# EAGLE design lower_traced (EAGLE 9.6.2)
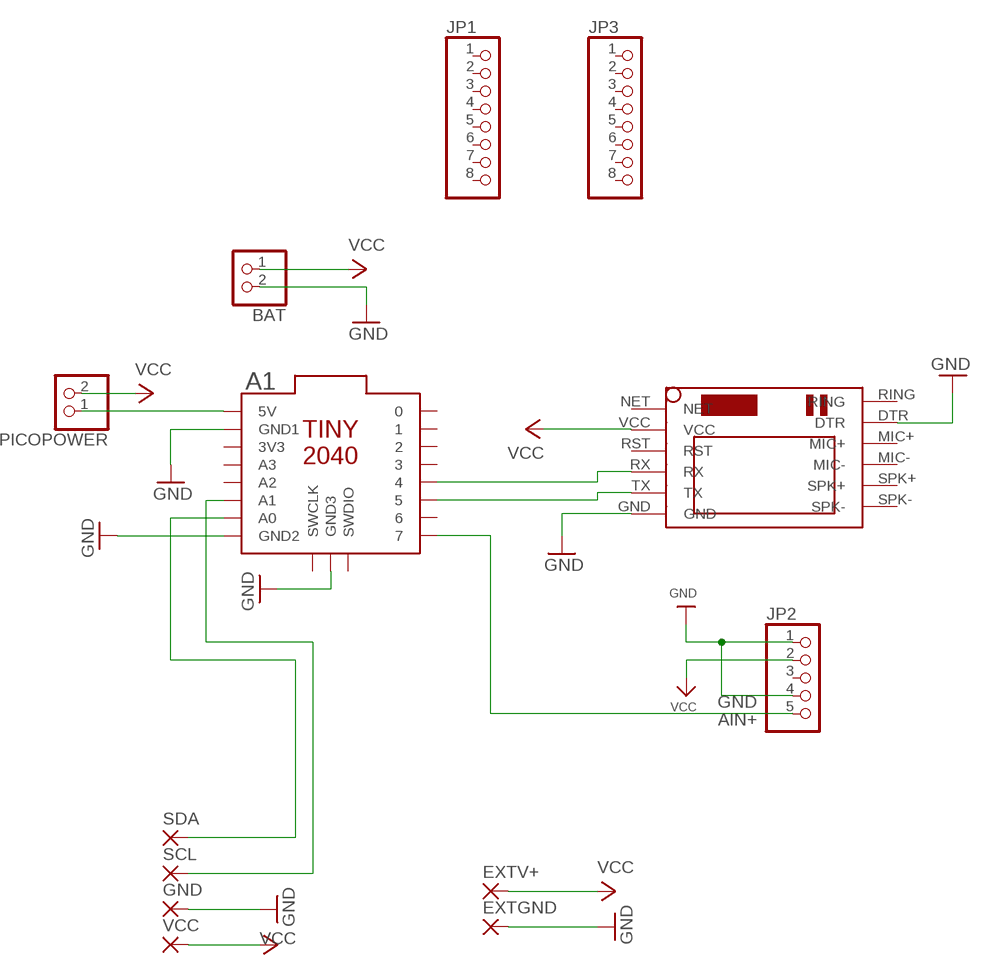
[diagram p0: schematic, sheet 1]

## Parts
A1  TINY2040  [TINY2040]
BAT  JST_2PIN-THM-RA  [JST-PH-2-THM-RA]
EXTGND  SMD5  [SMD2,54-5,08]
EXTV+  SMD5  [SMD2,54-5,08]
GND  3,17/1,1  [3,17/1,1]
JP1  PINHD-1X8  [1X08]
JP2  HEADER-1X570MIL  [1X05_ROUND_70]
JP3  PINHD-1X8  [1X08]
PICOPOWER  PINHD-1X2  [1X02]
SCL  3,17/1,1  [3,17/1,1]
SDA  3,17/1,1  [3,17/1,1]
U$2  SIM800LMODULE  [SIM800LMODULE]
VCC  3,17/1,1  [3,17/1,1]

## Nets
AIN+: A1.7 JP2.5
GND: A1.GND1 A1.GND2 A1.GND3 BAT.2 EXTGND.1(P) GND.1(P) JP2.1 JP2.4 U$2.DTR U$2.GND
N$1: A1.4 U$2.RX
N$2: A1.5 U$2.TX
N$3: A1.A1 SCL.1(P)
N$4: A1.A0 SDA.1(P)
N$5: A1.5V PICOPOWER.1
VCC: BAT.1 EXTV+.1(P) JP2.2 PICOPOWER.2 U$2.VCC VCC.1(P)
Unconnected: A1.0 A1.1 A1.2 A1.3 A1.3V3 A1.6 A1.A2 A1.A3 A1.SWCLK A1.SWDIO JP1.1 JP1.2 JP1.3 JP1.4 JP1.5 JP1.6 JP1.7 JP1.8 JP2.3 JP3.1 JP3.2 JP3.3 JP3.4 JP3.5 JP3.6 JP3.7 JP3.8 U$2.MIC+ U$2.MIC- U$2.NET U$2.RING U$2.RST U$2.SPK+ U$2.SPK-

## Library data of the parts
A1 = pimoroni-boards:TINY2040
BAT = adafruit:JST_2PIN: JST 2-Pin Connectors of various flavors SMT-RA (S2B-PH-SM4) 4UConnector #17311 SMT (B2B-PH-SM4) THM-RA (S2B-PH) THM (B2B-PH)
EXTGND EXTV+ = wirepad:SMD5: SMD PAD
GND SCL SDA VCC = wirepad:3,17/1,1: THROUGH-HOLE PAD
JP1 JP3 = pinhead:PINHD-1X8: PIN HEADER
JP2 = microbuilder:HEADER-1X5: PIN HEADER
PICOPOWER = pinhead:PINHD-1X2: PIN HEADER
U$2 = SIM800LMODULE:SIM800LMODULE: SIM800L Module

## Board
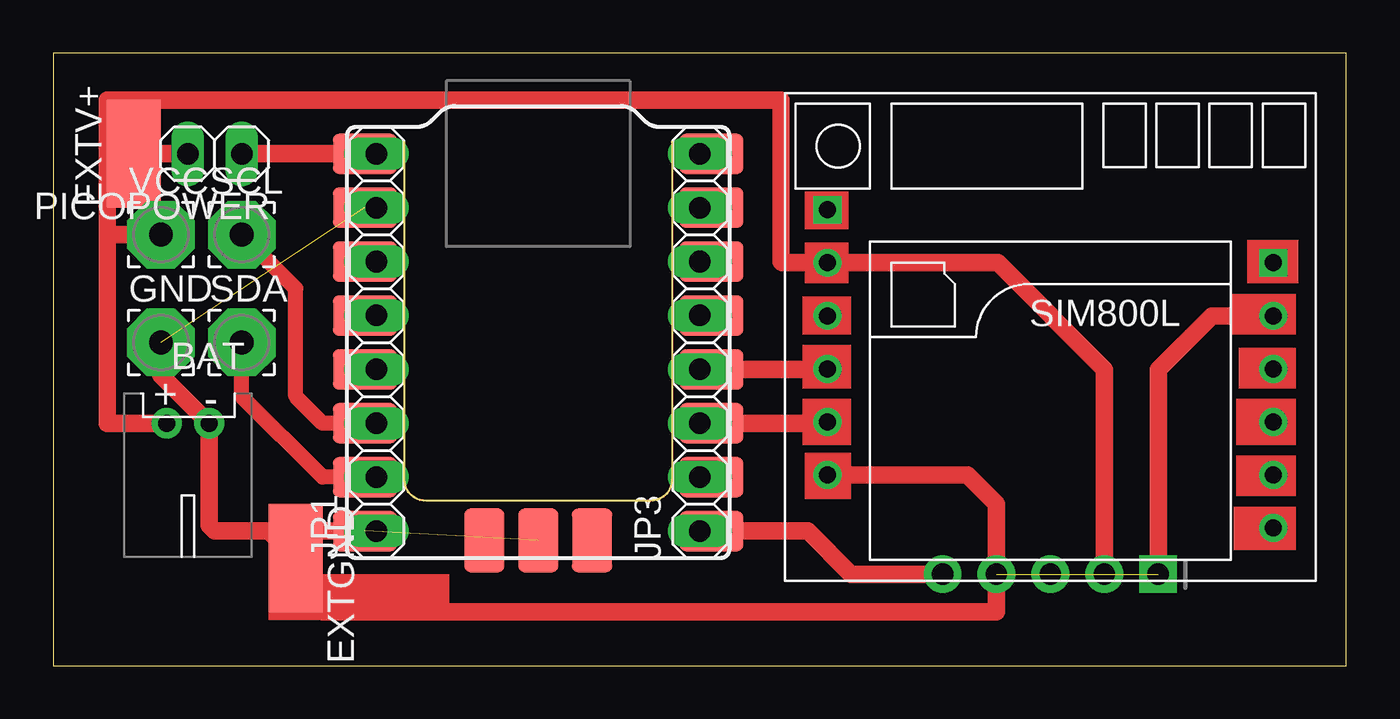
[diagram p1: board, top side]

Size 60.94 x 28.88 mm. Coordinates in mm from the lower left corner, seen from the top.
Outline: 0,0 60.94,0 60.94,28.88 0,28.88 0,0
Copper layers (1*16): Top 0.035mm / dielectric 1.5mm / Bottom 0.035mm
Design rules "default": minimum track width 6mil, minimum drill 0.35mm, track to track 6mil, track to pad 6mil, pad to pad 6mil, via to via 6mil, smd to smd 6mil, copper to edge 40mil, drill to drill 6mil, minimum pad ring 10mil, minimum via ring 8mil, stop-mask expansion 4mil, vias tented up to drill 0mil, thermal gap 10mil

### Footprints (pad centres in the part's own frame; a part is rotated, then mirrored left to right if it is on the bottom)
TINY2040 = smd 1.9 x 3: 0 1.27,8.17; 1 3.81,8.17; 2 6.35,8.17; 3 8.89,8.17; 3V3 6.35,-8.17; 4 11.43,8.17; 5 13.97,8.17; 5V 1.27,-8.17; 6 16.51,8.17; 7 19.05,8.17; A0 16.51,-8.17; A1 13.97,-8.17; A2 11.43,-8.17; A3 8.89,-8.17; GND1 3.81,-8.17; GND2 19.05,-8.17 | smd 3 x 1.9: GND3 19.49,0; SWCLK 19.49,-2.54; SWDIO 19.49,2.54
JST-PH-2-THM-RA = drill 0.8 pad 1.422: 1 1,0; 2 -1,0
SMD2,54-5,08 = smd 2.54 x 5.08: 1 0,0
3,17/1,1 = drill 1.118 pad 3.175 octagon: 1 0,0
1X08 = drill 1.016 long: 1 -8.89,0; 2 -6.35,0; 3 -3.81,0; 4 -1.27,0; 5 1.27,0; 6 3.81,0; 7 6.35,0; 8 8.89,0
1X05_ROUND_70 = drill 1 pad 1.778 square: 1 -5.08,0 | drill 1 pad 1.778: 2 -2.54,0; 3 0,0; 4 2.54,0; 5 5.08,0
1X02 = drill 1.016 long: 1 -1.27,0; 2 1.27,0
SIM800LMODULE = drill 0.8: DTR 10.5,1; GND -10.5,-6.5; MIC+ 10.5,-1.5; MIC- 10.5,-4; RST -10.5,1; RX -10.5,-1.5; SPK+ 10.5,-6.5; SPK- 10.5,-9; TX -10.5,-4; VCC -10.5,3.5 | drill 0.8 square: NET -10.5,6; RING 10.5,3.5

### Placement (x,y rotation side)
A1  22.86,25.4 270 top
BAT  6.35,11.43 180 top
EXTGND  11.43,5.08 180 top
EXTV+  3.81,24.13 0 top
GND  5.08,15.24 0 top
JP1  15.24,15.24 90 top
JP2  46.99,4.32 180 top
JP3  30.48,15.24 90 top
PICOPOWER  7.62,24.13 180 top
SCL  8.89,20.32 0 top
SDA  8.89,15.24 0 top
U$2  46.99,15.49 0 top
VCC  5.08,20.32 0 top

### Tracks (layer width: path | path; a pad name or v marks a point on that pad's centre or on a via)
AIN+
  Top 0.813: A1.7 35.56,6.35 37.59,4.32 JP2.5
GND  (3 unrouted)
  Top 0.813: JP2.1 52.07,13.97 54.59,16.49 U$2.DTR | U$2.GND 43.08,8.99 44.45,7.62 JP2.4 44.45,2.54 12.7,2.54 11.43,3.81 11.43,6.35 | A1.GND2 11.43,6.35 | 11.43,6.35 10.16,6.35 | 10.16,6.35 7.62,6.35 7.35,6.62 BAT.2 5.08,13.7 GND.1 | EXTGND.1 10.16,6.35
N$1
  Top 0.813: A1.4 36.47,13.97 U$2.RX
N$2
  Top 0.813: A1.5 36.43,11.43 U$2.TX
N$3
  Top 0.711: A1.A1 12.7,11.43 11.43,12.7 11.43,17.78 SCL.1
N$4
  Top 0.711: A1.A0 12.7,8.89 8.89,12.7 SDA.1
N$5
  Top 0.813: A1.5V PICOPOWER.1
VCC
  Top 0.813: JP2.2 49.53,13.97 44.51,18.99 U$2.VCC 34.35,18.99 34.29,19.05 34.29,26.67 2.54,26.67 2.54,24.13 | BAT.1 2.54,11.43 2.54,20.32 | 2.54,20.32 VCC.1 | 2.54,24.13 2.54,20.32 | PICOPOWER.2 EXTV+.1 2.54,24.13
(copper drawn outside any net)
  shapes: Top area x14